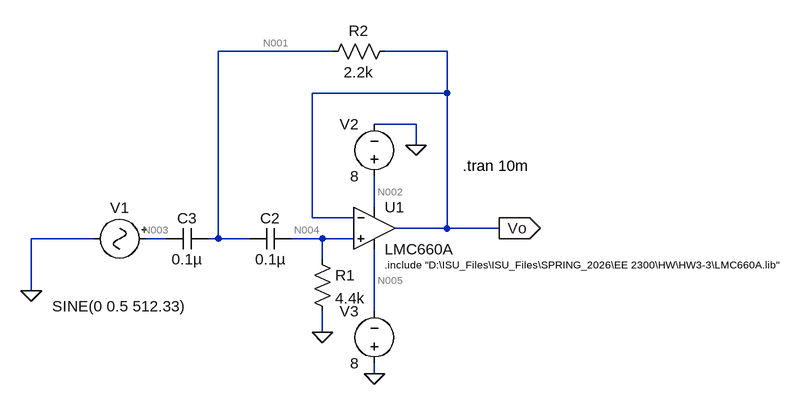
[diagram p0: schematic P2.asc]
P2.asc, the LTspice schematic file:
Version 4.1
SHEET 1 884 680
WIRE 144 -112 -32 -112
WIRE 320 -112 224 -112
WIRE 320 -48 320 -112
WIRE 320 -48 112 -48
WIRE 272 0 208 0
WIRE 272 32 272 0
WIRE 208 128 208 80
WIRE 112 144 112 -48
WIRE 176 144 112 144
WIRE 320 160 320 -48
WIRE 320 160 240 160
WIRE 400 160 320 160
WIRE -224 176 -320 176
WIRE -112 176 -144 176
WIRE -32 176 -32 -112
WIRE -32 176 -48 176
WIRE 16 176 -32 176
WIRE 128 176 80 176
WIRE 176 176 128 176
WIRE 128 208 128 176
WIRE -320 256 -320 176
WIRE 208 288 208 192
WIRE 128 320 128 288
WIRE 208 384 208 368
FLAG 128 320 0
FLAG -320 256 0
FLAG 400 160 Vo
IOPIN 400 160 Out
FLAG 272 32 0
FLAG 208 384 0
SYMBOL OpAmps\\opamp2 208 96 R0
SYMATTR InstName U1
SYMATTR Value LMC660A
SYMBOL cap 80 160 R90
WINDOW 0 0 32 VBottom 2
WINDOW 3 32 32 VTop 2
SYMATTR InstName C2
SYMATTR Value 0.1µ
SYMBOL cap -48 160 R90
WINDOW 0 0 32 VBottom 2
WINDOW 3 32 32 VTop 2
SYMATTR InstName C3
SYMATTR Value 0.1µ
SYMBOL res 112 192 R0
SYMATTR InstName R1
SYMATTR Value 4.4k
SYMBOL res 240 -128 R90
WINDOW 0 0 56 VBottom 2
WINDOW 3 32 56 VTop 2
SYMATTR InstName R2
SYMATTR Value 2.2k
SYMBOL Misc\\signal -128 176 R90
WINDOW 0 -32 56 VBottom 2
WINDOW 3 88 56 VTop 2
WINDOW 123 60 56 VTop 2
WINDOW 39 0 0 Left 0
SYMATTR InstName V1
SYMATTR Value SINE(0 0.5 512.33)
SYMBOL voltage 208 96 R180
WINDOW 0 24 96 Left 2
WINDOW 3 24 16 Left 2
WINDOW 123 0 0 Left 0
WINDOW 39 0 0 Left 0
SYMATTR InstName V2
SYMATTR Value 8
SYMBOL voltage 208 384 R180
WINDOW 0 24 96 Left 2
WINDOW 3 24 16 Left 2
WINDOW 123 0 0 Left 0
WINDOW 39 0 0 Left 0
SYMATTR InstName V3
SYMATTR Value 8
TEXT 224 216 Left 1 !.include "D:\\ISU_Files\\ISU_Files\\SPRING_2026\\EE 2300\\HW\\HW3-3\\LMC660A.lib"
TEXT 344 64 Left 2 !.tran 10m

The netlist it stands for:
* P2.asc
X§U1 N004 Vo N002 N005 Vo LMC660A  ; pins In+ In- V+ V- OUT
C2 N004 N001 0.1µ
C3 N001 N003 0.1µ
R1 N004 0 4.4k
R2 Vo N001 2.2k
V1 N003 0 SINE(0 0.5 512.33)
V2 N002 0 8
V3 0 N005 8
.include "D:\ISU_Files\ISU_Files\SPRING_2026\EE 2300\HW\HW3-3\LMC660A.lib"
.tran 10m
.backanno
.end

* Results of the author's LTspice run, read from the files saved beside the schematic
* Operating Point, zero values left out:
*   V(n001) = 3 mV
*   V(n002) = 8 V
*   V(n005) = -8 V
*   V(vo) = 3 mV
*   I(V2) = -416.3 µA
*   I(V3) = -416.3 µA
*   Ix(u1:50) = -416.3 µA
*   Ix(u1:99) = 416.3 µA
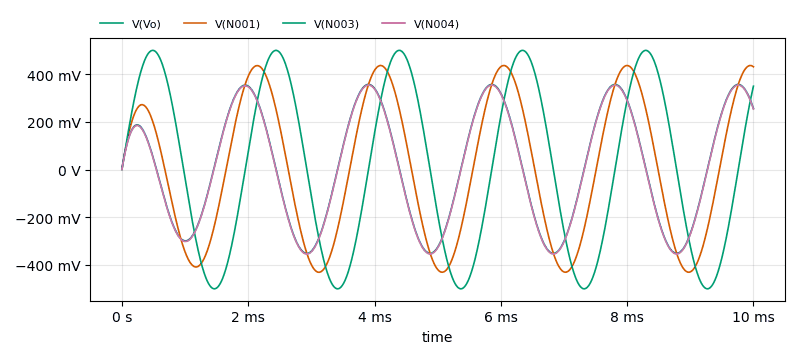
[diagram p1: Transient Analysis of P2.asc, plotted from the saved traces]
* Transient Analysis, 1 run:
*   V(Vo): min -351.4 mV, max 357.2 mV, average 10.67 mV, rms 244.2 mV, last 256.8 mV
*   V(N001): min -430.7 mV, max 436.5 mV, average 5.11 mV, rms 299.4 mV, last 431.2 mV
*   V(N003): min -500 mV, max 500 mV, average 4.432 mV, rms 350.8 mV, last 349.8 mV
*   V(N004): min -354.4 mV, max 354.2 mV, average 7.674 mV, rms 244 mV, last 253.7 mV